# Altium schematic sheet PowerSupplyInterface.SchDoc
size A4; SheetNumber: 12; SheetTotal: 14
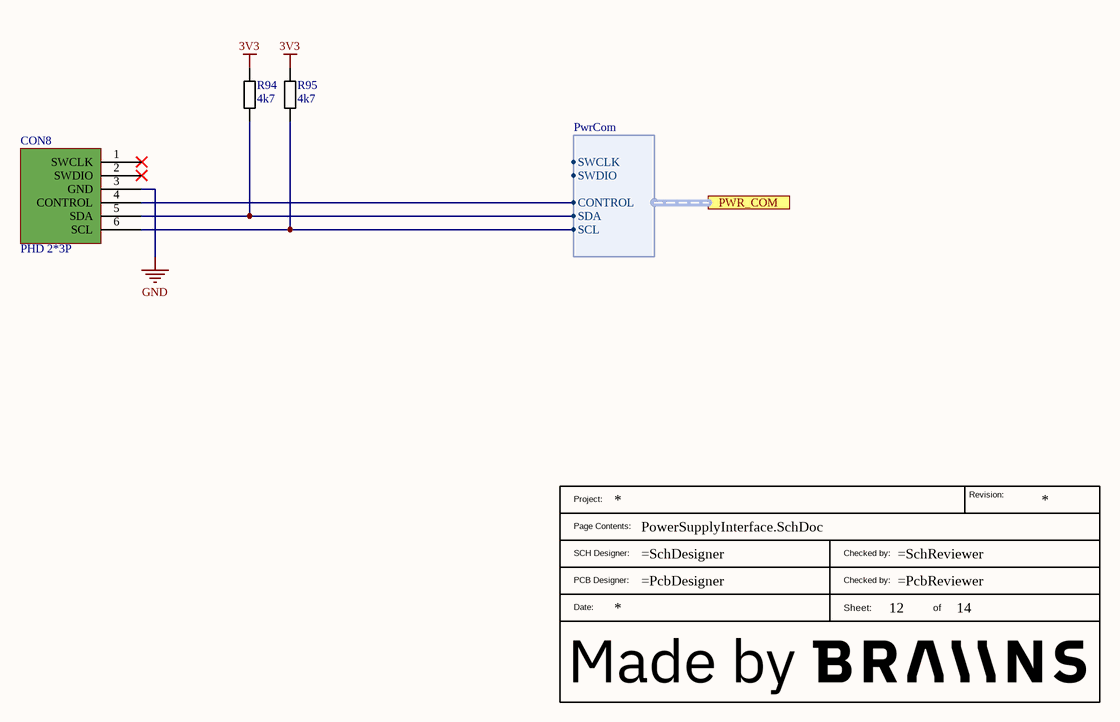
[diagram p0: PowerSupplyInterface.SchDoc]

## Parts
?  BraiinsTitleBlockWithLogo  (value not drawn)  (graphical)
CON8  PHD 2*3P  [C4201WR-2x3P]
R94  4k7  [RES0402]
R95  4k7  [RES0402]

## Ports
PWR_COM (harness PwrCom)

## Harnesses
PwrCom: SWCLK, SWDIO, CONTROL, SDA, SCL

## Nets
3V3: R94.1 R95.1
GND: CON8.3(GND)
NetCON8_4: CON8.4(CONTROL) ; port PWR_COM.CONTROL
NetCON8_5: CON8.5(SDA) R94.2 ; port PWR_COM.SDA
NetCON8_6: CON8.6(SCL) R95.2 ; port PWR_COM.SCL

Not connected (* = marked no-connect by the designer): CON8 1(SWCLK)* 2(SWDIO)*

## Notes on the sheet
- (in symbol BraiinsTitleBlockWithLogo) Revision:; Project:; Page Contents:; SCH Designer:; Checked by:; PCB Designer:; Date:; Sheet:; of

## Library data of the parts
CON8 = 30148: Miner Power Supply Com Connector 2x3pin; Part_Status: New; ID: 30148; Updated By: janjuranek; Value: PHD 2*3P; Part_Type: Connector; Manufacturer Part Number: PHD 2*3P; Manufacturer Part Description: Miner Power Supply Com Connector 2x3pin; Created By: janjuranek; Created_Date: 2023-04-27 15:30:40; Updated_Date: 2023-06-06 14:52:36; ComponentLink1Description: Datasheet; ComponentLink2Description: Supplier Part Details
R94 R95 = 30073: RES 4k7 Ohm 1% 0402; Part_Status: New; ID: 30073; Updated By: Jan; Sorted_Value: 4; Value: 4k7; Part_Type: Resistor; Manufacturer Part Description: RES 4k7 Ohm 1% 0402; Package_Case: 0402; RoHS: Yes; Tolerance: 1%; Created By: Jan; Created_Date: 2023-03-02 13:15:12; Updated_Date: 2023-03-02 13:15:46; ComponentLink1Description: Datasheet; ComponentLink2Description: Supplier Part Details; Temperature Range: -40 to +150C